# Altium schematic sheet isolated_dcdc_5to3.3.SchDoc
size A4
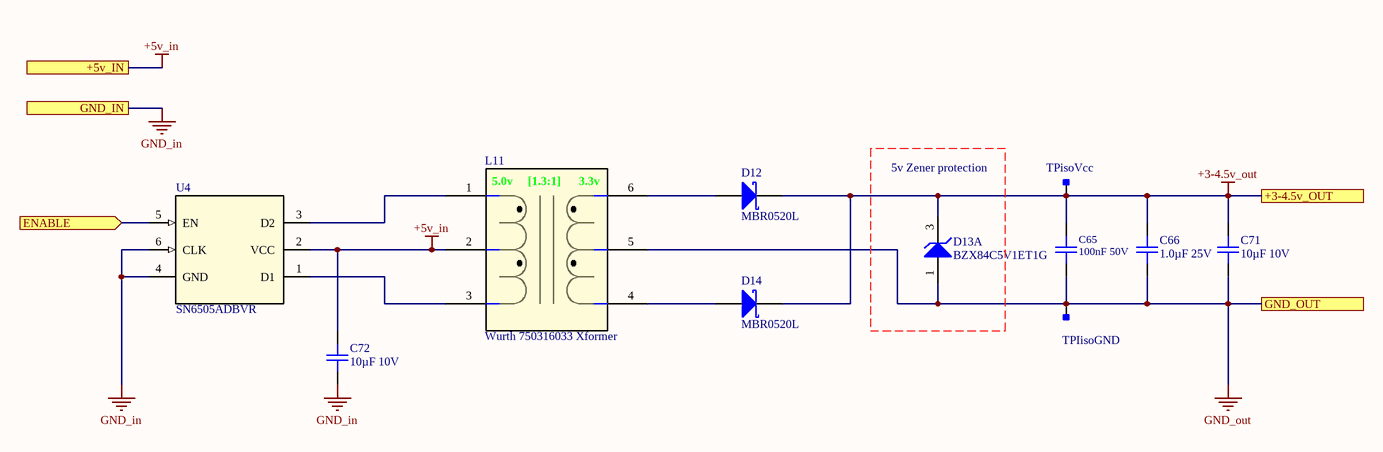
[diagram p0: isolated_dcdc_5to3.3.SchDoc]

## Parts
C65  100nF 50V  [0603C]
C66  1.0µF 25V  [0603C]
C71  10µF 10V  [0805C]
C72  10µF 10V  [0805C]
D12  MBR0520L  [ONSC-SOD-123-2-425-04_V]
D13  BZX84C5V1ET1G  [ONSC-SOT-23-3-318-08_V]  (part A of 2)
D14  MBR0520L  [ONSC-SOD-123-2-425-04_V]
L11  Wurth 750316033 Xformer  [750316033]
TPIisoGND  Testpoint_Square  [Testpoint_S1]  (value not drawn)  (no BOM)
TPisoVcc  Testpoint_Square  [Testpoint_S1]  (value not drawn)  (no BOM)
U4  SN6505ADBVR  [DBV0006A_N]

## Ports
+3-4.5v_OUT, +5v_IN, ENABLE (in), GND_IN, GND_OUT

## Nets
+3-4.5v_out: C65.2 C66.2 C71.2 D12.1(K) D13.3(K) D14.1(K) TPisoVcc.1 ; port +3-4.5v_OUT
+5v_in: C72.2 L11.2 U4.2(VCC) ; port +5v_IN
GND_in: C72.1 U4.4(GND) U4.6(CLK) ; port GND_IN
GND_out: C65.1 C66.1 C71.1 D13.1(A) TPIisoGND.1 ; port GND_OUT
ENABLE: U4.5(EN) ; port ENABLE
NetL11_1: L11.1 U4.3(D2)
NetL11_3: L11.3 U4.1(D1)

Not connected (* = marked no-connect by the designer): D12 2(A); D14 2(A); L11 4 5 6

## Notes on the sheet
- 5v Zener protection
- (in symbol 750316033) 5.0v     [1.3:1]      3.3v

## Library data of the parts
C65 = gen_C_ceramic_100n_50V_X7R_0603: Ceramic, 100nF, ±10%, 50V, X7R, –55 to 125°C, 0603 (1608),RoHS, Automotive; Part Number: GCJ188R71H104KA12; Manufacturer: Murata; Capacitance: 100n; Case EIA: 0603; Case Metric: 1608; Automotive Qualified: True; PnP Package: C_0603_10; PnP Value: 100nF/50V/X7R; Dielectric: X7R; Rated Voltage: 50V; Height - Seated (Max): 0.8mm; Mounting Type: SurfaceMount,MLCC; Operating Temperature: –55 to 125°C; Series: GCJ; Tolerance: ±10%; Manufacturer_Part_Number: GCJ188R71H104KA12; Supplier 1: Digi-Key; Supplier Part Number 1: 490-5798-1-ND
C66 = gen_C_ceramic_1u_25V_X7R_0603: Ceramic, 1.0µF, ±10%, 25V, X7R, –55 to 125°C, 0603 (1608),RoHS, Automotive; Part Number: GCJ188R71E105KA01; Manufacturer: Murata; Case EIA: 0603; Case Metric: 1608; Capacitance: 1µF; Automotive Qualified: True; PnP Package: C_0603_10; PnP Value: 1.0µF/25V/X7R; Dielectric: X7R; Rated Voltage: 25V; Height - Seated (Max): 0.8mm; Mounting Type: SurfaceMount,MLCC; Operating Temperature: –55 to 125°C; Series: GCJ; Tolerance: ±10%; Manufacturer_Part_Number: GCJ188R71E105KA01; Supplier 1: Digi-Key; Supplier Part Number 1: 490-14409-1-ND
C71 C72 = gen_C_ceramic_10u_10V_X7R_0805: Ceramic, 10µF, ±10%, 10V, X7R, –55 to 125°C, 0805 (2012),RoHS, Automotive; Part Number: GCJ21BR71A106KE01; Manufacturer: Murata; Case EIA: 0805; Case Metric: 2012; Automotive Qualified: True; PnP Package: C_0805_10; PnP Value: 10µF/10V/X7R; Capacitance: 10µF; Dielectric: X7R; Rated Voltage: 10V; Height - Seated (Max): 1.25mm; Mounting Type: SurfaceMount,MLCC; Operating Temperature: –55 to 125°C; Series: GCJ; Tolerance: ±10%; Manufacturer_Part_Number: GCJ21BR71A106KE01; Supplier 1: Digi-Key; Supplier Part Number 1: 490-12646-1-ND
D12 D14 = CMP-2000-04926-1: Schottky Diode, 20V, 0.2A, 2-pin SOD-123, RoHS, Tape and Reel; Manufacturer: FairchildSemiconductor; Peak Forward Voltage: 0.385V; Rad Hard: No; Peak Non-Repetitive Surge Current: 5.5A; Peak Average Forward Current: 0.5A; Peak Reverse Current: 250uA; Configuration: Single; Mounting: SurfaceMount; Operating Temperature: -65to125degC; Datasheet URL: https://datasheet.ciiva.com/5739/1684450-5739282.pdf; Package Reference: SOD-123-2-425-04; Package Description: 2-Pin Small Outline Diode, Body 2.69 x 1.6 mm; Type: SchottkyDiode; Datasheet Version: Rev. C0, 03/2012; Manufacturer URL: https://www.fairchildsemi.com/; Peak Reverse Repetitive Voltage: 20V; Package: 2SOD-123; Packaging: Tape&Reel; Category: Rectifier
D13 = CMP-1060-00940-1: Zener Voltage Regulator, 225 mW, 3-Pin SOT-23, Pb-Free, Tape and Reel; Manufacturer: On Semiconductor; PackageReference: SOT-23-3-318-08; Mounting Technology: Surface Mount; ComponentLink2URL: http://www.onsemi.com/pub_link/Collateral/BZX84C2V4ET1-D.PDF; PackageVersion: Rev. AP, 11/2009; PartNumber: BZX84C5V1ET1G; Packing: Tape and Reel; ComponentLink3URL: http://www.onsemi.cn/pub_link/Collateral/318-08.PDF; RoHS: Pb-Free; ComponentLink2Description: Datasheet; ComponentLink1Description: Manufacturer URL; DatasheetVersion: Rev. 8; ComponentLink3Description: Package Specification; ComponentLink1URL: http://www.onsemi.com/; PackageDescription: 3-Pin Small Outline Transistor, Body 2.92 x 1.3 mm, Pitch 0.95 mm; PartId: 1
L11 = 750316033: Isolated interface power supply for CAN, RS-485, RS-422, RS-232, SPI, I2C, lower-power LAN; Manufacturer_Part_Number: 50225C; Vendor: Murata; Built_By: EMA_UL_Team; Type: DEV; Copyright: Copyright (C) 2018 Accelerated Designs. All rights reserved; RefDes: RefDes; Value: Value
TPIisoGND TPisoVcc = Testpoint_Square: Testpoint, square; Part Number: Testpoint_Square
U4 = SN6505ADBVR: Imported; Alternate_PartNumber: SN6505ADBVT; Manufacturer: Texas Instruments; CompType: IC; PIN_COUNT: 6; Application_BuildNumber: *; PartNumber: SN6505ADBVR; PackageReference: DBV0006A; MountType: SMT; RefDes: RefDes; TYPE: TYPE; Value: Value